# EAGLE design test_rj45-12_THT (EAGLE 6.5.0)
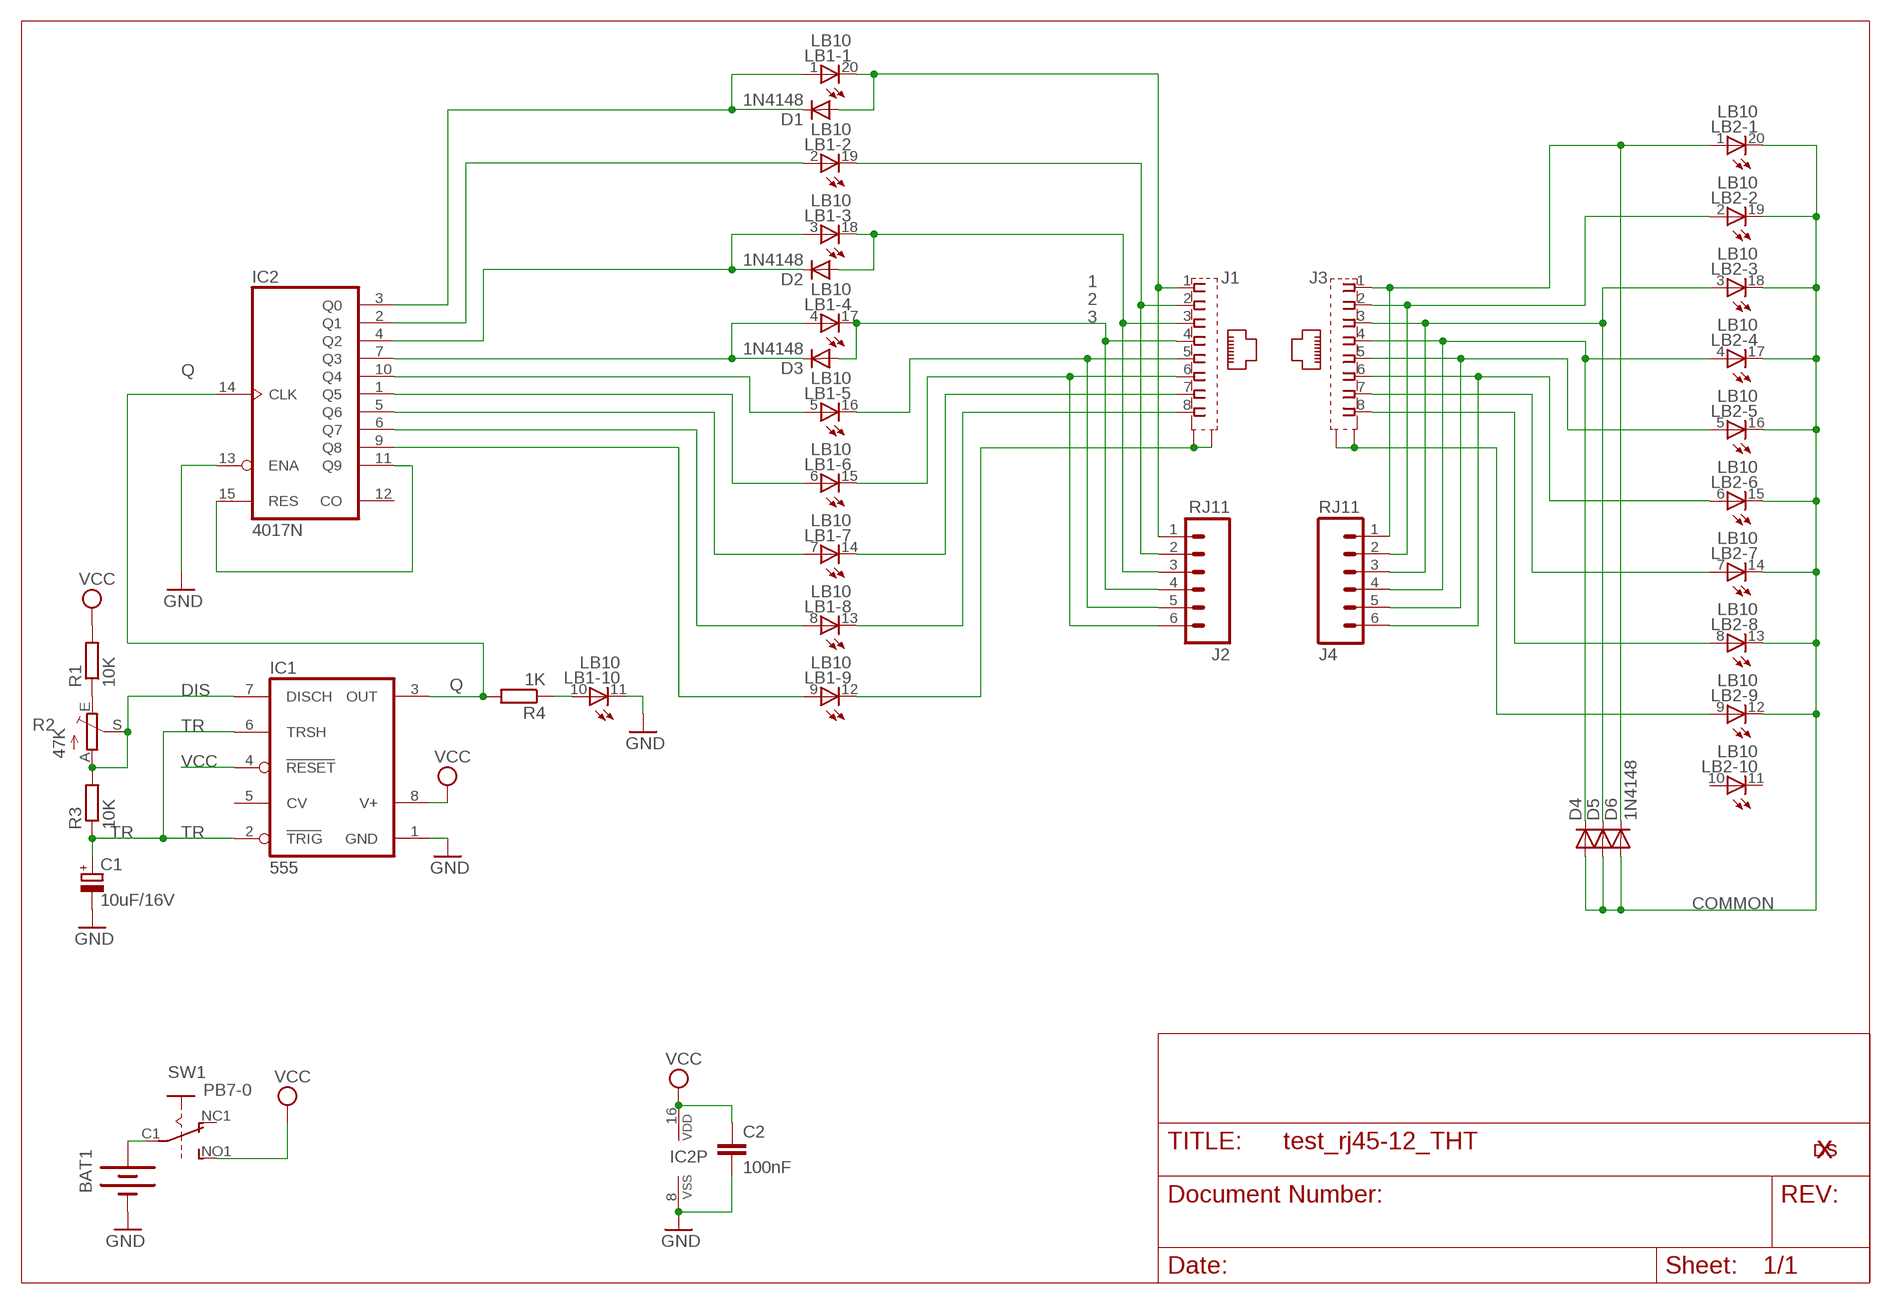
[diagram p0: schematic, sheet 1]

## Parts
$1_23_$  XDESIG21  [XDESIG]
BAT1  BATTERY9V  [BATTCON_9V]
C1  10uF/16V  CPOL-EUE2.5-6  [E2,5-6]
C2  100nF  C2.5/2  [C2.5-2]
D1  1N4148  DIODE-D-2.5  [D-2.5]
D2  1N4148  DIODE-D-2.5  [D-2.5]
D3  1N4148  DIODE-D-2.5  [D-2.5]
D4  DIODE-D-2.5  [D-2.5]
D5  DIODE-D-2.5  [D-2.5]
D6  1N4148  DIODE-D-2.5  [D-2.5]
IC1  555  ICM7555  [DIL08]
IC2  4017N  [DIL16]
J1  555153-1  [555153-1]
J2  RJ11  RJ11-6PTH  [RJ11-6]
J3  555153-1  [555153-1]
J4  RJ11  RJ11-6PTH  [RJ11-6]
LB1  LB10  [LB10]
LB2  LB10  [LB10]
R1  10K  R-EU_0204/7  [0204/7]
R2  47K  TRIM_EU-CA6V  [CA6V]
R3  10K  R-EU_0204/7  [0204/7]
R4  1K  R-EU_0204/7  [0204/7]
SW1  PB7-0  [PB07_0]
U$6  XDESIG5MM  [XDESIG_CU]

## Nets
1: D1.A J1.1 J2.1 LB1.20(-1:C)
2: J1.2 J2.2 LB1.19(-2:C)
3: D2.A J1.3 J2.3 LB1.18(-3:C)
4: D3.A J1.4 J2.4 LB1.17(-4:C)
COMMON: D4.A D5.A D6.A LB2.12(-9:C) LB2.13(-8:C) LB2.14(-7:C) LB2.15(-6:C) LB2.16(-5:C) LB2.17(-4:C) LB2.18(-3:C) LB2.19(-2:C) LB2.20(-1:C)
DIS: IC1.7(DISCH) R2.A R2.S R3.2
G: J1.G1(S1) J1.G2(S2) LB1.12(-9:C)
GND: BAT1.- C1.- C2.2 IC1.1(GND) IC2.8(VSS) IC2.13(ENA) LB1.11(-10:C)
N$1: IC2.11(Q9) IC2.15(RES)
N$2: J3.2 J4.2 LB2.2(-2:A)
N$3: D1.C IC2.3(Q0) LB1.1(-1:A)
N$4: D2.C IC2.4(Q2) LB1.3(-3:A)
N$5: D5.C J3.3 J4.3 LB2.3(-3:A)
N$7: D4.C J3.4 J4.4 LB2.4(-4:A)
N$8: J3.5 J4.5 LB2.5(-5:A)
N$9: J1.5 J2.5 LB1.16(-5:C)
N$10: IC2.9(Q8) LB1.9(-9:A)
N$11: J1.6 J2.6 LB1.15(-6:C)
N$12: J3.6 J4.6 LB2.6(-6:A)
N$13: IC2.2(Q1) LB1.2(-2:A)
N$15: J3.7 LB2.7(-7:A)
N$16: J3.8 LB2.8(-8:A)
N$17: J3.G1(S1) J3.G2(S2) LB2.9(-9:A)
N$18: D3.C IC2.7(Q3) LB1.4(-4:A)
N$20: D6.C J3.1 J4.1 LB2.1(-1:A)
N$21: R1.1 R2.E
N$22: BAT1.+ SW1.C1(P)
N$23: IC2.10(Q4) LB1.5(-5:A)
N$24: J1.7 LB1.14(-7:C)
N$25: J1.8 LB1.13(-8:C)
N$26: IC2.1(Q5) LB1.6(-6:A)
N$27: IC2.5(Q6) LB1.7(-7:A)
N$28: IC2.6(Q7) LB1.8(-8:A)
N$32: LB1.10(-10:A) R4.1
Q: IC1.3(OUT) IC2.14(CLK) R4.2
TR: C1.+ IC1.2(TRIG) IC1.6(TRSH) R3.1
VCC: C2.1 IC1.4(RESET) IC1.8(V+) IC2.16(VDD) R1.2 SW1.NO1(S)
Unconnected: IC1.5(CV) IC2.12(CO) LB2.10(-10:A) LB2.11(-10:C) SW1.C2(P) SW1.NC1(O) SW1.NC2(O) SW1.NO2(S)

## Library data of the parts
$1_23_$ U$6 = xdesig:XDESIG
BAT1 = SparkFun-Electromechanical:BATTERY: Battery Holders Various common sizes : AA, AAA, 18650 (PRT-12895), 20mm coin cell and 12mm coin cell. 20MM_4LEGS, BATT-10373
C1 = rcl:CPOL-EU: POLARIZED CAPACITOR, European symbol
C2 = capacitor-wima:C: CAPACITOR naming: grid - package width
D1-D6 = diode:DIODE-: DIODE
IC1 = maxim:ICM7555: TIMER; MF: MAXIM; MPN: ICM7555IPA+; OC_FARNELL: 9663762; OC_NEWARK: 68K4387
IC2 = 40xx:4017: COUNTER/DIVIDER
J1 J3 = con-amp:555153-1: AMP connector
J2 J4 = SparkFun-Connectors:RJ11-6: RJ11 Jack Simple 6 pin RJ11 jack. Commonly found on CAT3 devices and Microchip programmers. SKU: PRT-00132; PROD_ID: CONN-08590
LB1 LB2 = led:LB10: LED BLOCK 10-LED bar graph, DIL, Siemens
R1 R3 R4 = rcl:R-EU_: RESISTOR, European symbol
R2 = pot:TRIM_EU-: POTENTIOMETER
SW1 = switch:PB7-0

## Net classes
0 default: width 0.254 mm, drill 0.61 mm, clearance 0.254 mm
1 power: width 0.254 mm, drill 0.61 mm, clearance 0.254 mm

## Board
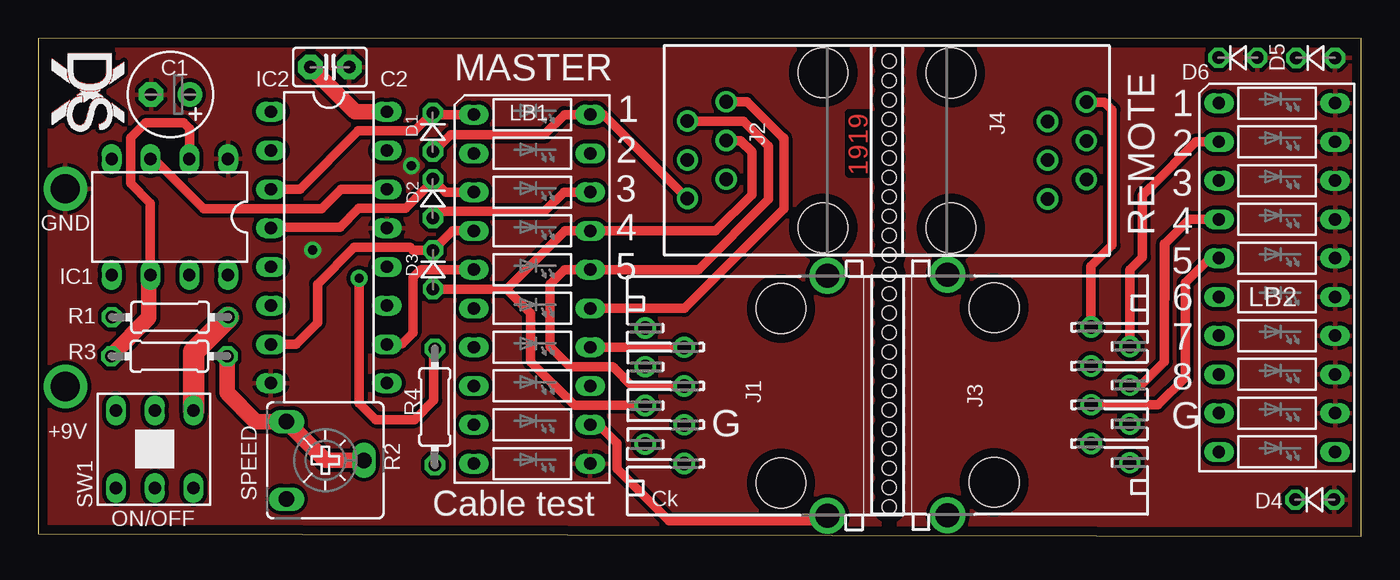
[diagram p1: board, top side]
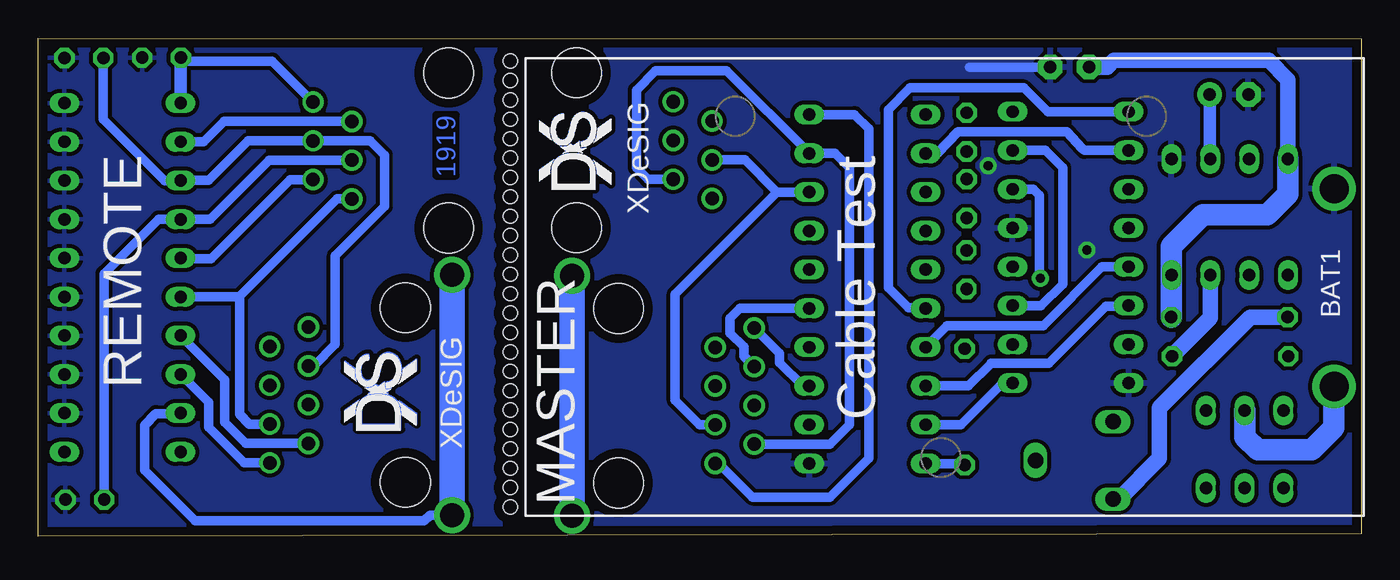
[diagram p2: board, bottom side, seen from below]

Size 86.73 x 32.62 mm. Coordinates in mm from the lower left corner, seen from the top.
Outline: 0.02,0.14 86.73,0 86.73,32.62 0,32.58 0.02,0.14
Copper layers (1*16): Top 0.035mm / dielectric 1.5mm / Bottom 0.035mm
Design rules "default": minimum track width 10mil, minimum drill 22mil, track to track 10mil, track to pad 10mil, pad to pad 8mil, via to via 12mil, smd to smd 8mil, copper to edge 24mil, drill to drill 12mil, minimum pad ring 10mil, minimum via ring 10mil, stop-mask expansion 2mil, vias tented up to drill 30mil, thermal gap 10mil
Holes 0.9 mm at 55.77,29.84 55.77,28.57 55.77,27.3 55.77,26.04 55.77,24.77 55.77,23.5 55.77,22.23 55.77,20.95 55.77,19.68 55.77,18.41 55.77,17.14 55.77,15.88 55.77,14.61 55.77,13.34 55.77,12.06 55.77,10.79 55.77,9.53 55.77,8.26 55.77,6.99 55.77,5.71 55.77,4.45 55.77,3.17 55.77,31.11 55.77,1.91
bRestrict: area 55.1,3.8 to 56.4,29.2

### Footprints (pad centres in the part's own frame; a part is rotated, then mirrored left to right if it is on the bottom)
BATTCON_9V = drill 1.905: + 0,-12.954; - 0,0
E2,5-6 = drill 0.813 pad 1.6: + -1.27,0 | drill 0.813 pad 1.6 octagon: - 1.27,0
C2.5-2 = drill 0.813 pad 1.6 octagon: 1 -1.27,0; 2 1.27,0
D-2.5 = drill 0.813 octagon: A 1.27,0; C -1.27,0
DIL08 = drill 0.813 long: 1 -3.81,-3.81; 2 -1.27,-3.81; 3 1.27,-3.81; 4 3.81,-3.81; 5 3.81,3.81; 6 1.27,3.81; 7 -1.27,3.81; 8 -3.81,3.81
DIL16 = drill 0.813 long: 1 -8.89,-3.81; 2 -6.35,-3.81; 3 -3.81,-3.81; 4 -1.27,-3.81; 5 1.27,-3.81; 6 3.81,-3.81; 7 6.35,-3.81; 8 8.89,-3.81; 9 8.89,3.81; 10 6.35,3.81; 11 3.81,3.81; 12 1.27,3.81; 13 -1.27,3.81; 14 -3.81,3.81; 15 -6.35,3.81; 16 -8.89,3.81
555153-1 = drill 0.889: 1 -4.445,6.35; 2 -3.175,8.89; 3 -1.905,6.35; 4 -0.635,8.89; 5 0.635,6.35; 6 1.905,8.89; 7 3.175,6.35; 8 4.445,8.89 | drill 1.575 pad 2.184: G1 -7.874,-3.048; G2 7.874,-3.048 | hole 3.251: -5.715,0; 5.715,0
RJ11-6 = drill 0.889: 1 -3.175,8.89; 2 -1.905,6.35; 3 -0.635,8.89; 4 0.635,6.35; 5 1.905,8.89; 6 3.175,6.35 | hole 3.251: -5.08,0; 5.08,0
LB10 = drill 0.813 long: 1 -11.43,-3.81; 2 -8.89,-3.81; 3 -6.35,-3.81; 4 -3.81,-3.81; 5 -1.27,-3.81; 6 1.27,-3.81; 7 3.81,-3.81; 8 6.35,-3.81; 9 8.89,-3.81; 10 11.43,-3.81; 11 11.43,3.81; 12 8.89,3.81; 13 6.35,3.81; 14 3.81,3.81; 15 1.27,3.81; 16 -1.27,3.81; 17 -3.81,3.81; 18 -6.35,3.81; 19 -8.89,3.81; 20 -11.43,3.81
0204/7 = drill 0.813 octagon: 1 -3.81,0; 2 3.81,0
CA6V = drill 1.016 long: A -2.54,-2.54; E 2.54,-2.54; S 0,2.54
PB07_0 = drill 0.813 long: C1 0,2.54; C2 0,-2.54; NC1 -2.54,2.54; NC2 -2.54,-2.54; NO1 2.54,2.54; NO2 2.54,-2.54

### Placement (x,y rotation side)
$1_23_$  0.91,31.57 270 top
BAT1  1.78,22.75 0 bottom
C1  8.67,28.93 180 top
C2  19.12,30.73 0 top
D1  25.87,26.46 270 top
D2  25.87,22.11 270 top
D3  25.88,17.45 270 top
D4  83.67,2.38 0 top
D5  83.73,31.32 0 top
D6  78.64,31.34 0 top
IC1  8.63,20.9 180 top
IC2  19.06,18.91 270 top
J1  48.69,9.19 90 top
J2  51.45,25.28 90 top
J3  62.66,9.24 270 top
J4  59.82,25.26 270 top
LB1  32.38,16.18 270 top
LB2  81.2,16.94 270 top
R1  8.65,14.34 0 top
R2  18.83,4.96 270 top
R3  8.6,11.78 0 top
R4  26,8.46 90 top
SW1  7.64,5.7 0 top
U$1  XDESIG5MM  [XDESIG_CU]  0.9,31.61 270 top
U$2  XDESIG5MM  [XDESIG_CU]  61.91,6.99 90 bottom
U$3  XDESIG21  [XDESIG]  61.95,6.91 90 bottom
U$5  XDESIG21  [XDESIG]  49.16,22.71 90 bottom
U$6  49.17,22.72 90 bottom

### Tracks (layer width: path | path; a pad name or v marks a point on that pad's centre or on a via)
1
  Top 0.61: J2.1 37.05,27.61 LB1.20 34.49,27.61 33.17,26.29 27.03,26.29 25.93,25.19 D1.A
  Bottom 0.61: LB1.20 33.22,27.61 32.28,26.67 32.28,5.08 34.82,2.54 39.9,2.54 42.1,4.75 J1.1
2
  Bottom 0.61: J1.2 34.82,6.01 33.55,7.29 33.55,24.13 34.49,25.07 LB1.19 41.6,30.48 46.25,30.48 47.52,29.21 47.52,24.13 46.77,23.38 J2.2
3
  Top 0.61: D2.A 26.3,21.27 33.2,21.27 34.46,22.53 LB1.18
  Bottom 0.61: J2.3 40.41,24.64 38.3,22.53 | LB1.18 38.3,22.53 | J1.3 43.38,7.29 44.98,8.89 44.98,15.85 38.3,22.53
4
  Top 0.61: D3.A 30.71,16.18 | 30.71,16.18 34.52,19.99 LB1.17 44.41,19.99 46.79,22.37 46.79,25.17 46.05,25.91 J2.4 | J1.4 35.16,8.55 32.28,11.43 32.28,14.61 30.71,16.18
COMMON
  pour Bottom: 56.41,33.02 86.89,33.02 88.16,0 56.41,0
  pour Top: 56.41,33.02 86.89,33.02 86.89,0 56.41,0
DIS
  Top 1.016: R2.S 18.83,4.96 R2.A 14.27,7.5 12.38,9.39 12.38,11.75 R3.2
  Bottom 1.016: R3.2 9.9,14.3 IC1.7
G
  Top 0.61: LB1.12 36.73,7.29 37.94,6.08 37.94,4.41 41.36,0.99 51.41,0.99 J1.G1
  Bottom 1.676: J1.G2 J1.G1
GND  (via drill 0.6)
  Bottom 0.61: C2.2 25.68,30.73
  other vias: 18,18.74 24.46,24.27
  pour Bottom: -0.74,33.02 55.14,33.02 55.14,0 -0.74,0
  pour Top: -0.74,33.02 55.14,33.02 55.14,0 -0.74,0
N$1
  Bottom 0.61: IC2.11 20.99,15.1 19.58,16.51 19.58,24.13 20.71,25.26 IC2.15
N$2
  Top 0.61: 72.92,22.86 72.92,22.85 | 72.92,22.85 75.89,25.82 LB2.2 | J3.2 71.55,17.43 72.39,18.27 72.39,22.32 72.92,22.85
  Bottom 0.61: J4.2 74.55,27.16 75.89,25.82 LB2.2
N$3
  Top 0.61: LB1.1 25.99,27.61 D1.C 24.68,26.54 20.98,26.54 17.16,22.72 IC2.3
N$4
  Top 0.61: LB1.3 26.72,22.53 D2.C 25.87,23.25 24.08,21.46 21.02,21.46 19.79,20.23 15.3,20.23 IC2.4
N$5
  Bottom 0.61: D5.C 82.46,27.32 78.43,23.29 LB2.3 77.37,23.31 75.56,23.31 72.98,25.89 J4.3 64.97,25.89 64.03,24.96 64.03,21.59 67.25,18.37 67.25,12.55 68.66,11.14 J3.3
N$7
  Top 0.61: 73.84,15.5 73.84,19.16 | 73.84,19.16 75.44,20.76 LB2.4 | J3.4 72.28,9.88 73.83,11.43 73.83,19.15 73.84,19.16
  Bottom 0.61: J4.4 71.58,24.62 75.44,20.76 LB2.4 | LB2.4 | D4.C 82.4,17.19 78.83,20.76 LB2.4
N$8
  Top 0.61: J3.5 73.41,8.61 75.18,10.38 75.18,16.58 76.78,18.18 77.36,18.18 LB2.5
  Bottom 0.61: J4.5 70.22,23.36 75.39,18.18 77.36,18.18 LB2.5
N$9
  Top 0.61: J1.5 38.93,9.82 37.74,11.02 37.73,11.02 37.66,11.09 34.86,11.09 33.55,12.4 33.55,16.51 34.49,17.45 LB1.16 43.28,17.45 47.88,22.05 47.88,25.55 46.24,27.18 J2.5
N$10
  Bottom 0.61: IC2.9 23.53,10.02 26.26,7.29 LB1.9
N$11
  Top 0.61: J2.6 46.46,28.45 48.75,26.17 48.77,26.17 48.87,26.07 48.87,21.44 42.35,14.92 LB1.15
  Bottom 0.61: LB1.15 40.73,14.91 41.38,14.26 41.38,13.29 40.48,12.39 40.48,11.78 J1.6
N$12
  Bottom 0.61: J3.6 72.9,7.33 73.53,7.97 73.53,15.66 73.54,15.67 | LB2.6 73.54,15.67 | 73.54,15.67 73.54,15.68 67.14,22.09 J4.6
N$13
  Bottom 0.61: LB1.2 27.79,25.07 26.44,26.49 19.29,26.49 18.31,25.4 18.17,25.26 IC2.2
N$15
  Bottom 0.61: J3.7 73.12,6.07 74.5,7.44 74.5,10.24 LB2.7
N$16
  Bottom 0.61: J3.8 73.22,4.79 75.55,7.13 75.55,8.75 LB2.8
N$17
  Bottom 0.61: J3.G2 61.04,1.37 61.42,0.99 76.43,0.99 79.76,4.32 79.76,7.27 79.01,8.02 77.42,8.02 LB2.9
  Bottom 1.676: J3.G1 J3.G2
N$18
  Top 0.61: LB1.4 27.15,19.99 D3.C 24.57,18.72 24.38,18.91 20.71,18.91 18.31,16.51 18.31,13.97 16.9,12.56 IC2.7
N$20
  Top 0.61: J4.1 69.89,28.43 70.38,27.94 70.38,19.05 69.01,17.68 J3.1
  Bottom 0.254: 77.37,31.11 D6.C
  Bottom 0.61: 77.37,31.11 71.39,31.11 J4.1
  Bottom 0.813: D6.C 77.39,31.34 LB2.1
N$21
  Bottom 1.016: R1.1 7.28,14.34 13.23,8.39 13.23,5.08 15.89,2.42 R2.E
N$22
  Bottom 1.422: SW1.C1 7.64,6.49 6.8,5.64 3.25,5.64 1.8,7.09 1.8,9.78 BAT1.+
N$23
  Top 0.61: LB1.5 25.07,17.45 24.57,16.95 24.57,13.33 23.84,12.6 22.91,12.6 IC2.10
N$24
  Top 0.61: LB1.14 J1.7
N$25
  Bottom 0.61: LB1.13 36.61,9.83 38.14,11.36 38.14,11.97 J1.8
N$26
  Bottom 0.61: IC2.1 20.55,27.8 22.12,29.37 29.58,29.37 31.01,27.94 31.01,16.28 29.68,14.95 28.61,14.95 LB1.6
N$27
  Bottom 0.61: LB1.7 27.15,13.79 20.85,13.79 17,17.64 IC2.5
N$28
  Bottom 0.61: LB1.8 25.76,9.83 24.33,11.26 24.33,11.27 24.27,11.33 20.48,11.33 16.74,15.07 15.28,15.07 IC2.6
N$32
  Bottom 0.61: LB1.10 26.1,4.75 R4.1
Q  (via drill 0.6)
  Top 0.61: IC1.3 7.58,24.71 10.86,21.43 18.58,21.43 19.87,22.72 IC2.14 | v21.04,16.89 21.04,8.7 22.12,7.62 24.66,7.62 25.93,8.89 25.93,12.2 R4.2
  Bottom 0.61: IC2.14 21.51,22.72 21.1,22.31 21.1,16.95 v21.04,16.89
TR
  Top 0.61: IC1.6 7.36,21.81 6.06,23.11 6.06,26.09 7.04,27.07 9.54,27.07 9.94,26.67 9.94,24.75 IC1.2
  Top 1.016: R3.1 4.79,11.82 7.26,14.29 7.26,16.99 IC1.6
  Bottom 0.813: C1.+ 9.94,24.75 IC1.2
VCC
  Top 1.016: IC2.16 20.78,27.8 C2.1
  Top 1.422: SW1.NO1 10.19,12.06 R1.2
  Bottom 1.016: C2.1 17.83,30.71 16.66,30.71 16.21,31.16 6.07,31.16 4.81,29.9 IC1.4
  Bottom 1.422: R1.2 12.46,17.07 IC1.8 12.44,18.99 10.39,21.04 6.16,21.04 4.82,22.38 IC1.4

### Text on the board
Top: 1919
Bottom: 1919
tPlace: MASTER | 1 | 1 | REMOTE | 2 | 2 | 3 | 3 | GND | 4 | 4 | 5 | 5 | 6 | 7 | 8 | +9V | SPEED | G | G | ON/OFF | Cable test | Ck
bPlace: XDeSIG | REMOTE | Cable Test | MASTER | XDeSIG